# EAGLE design LoRa.v01h (EAGLE 7.7.0)
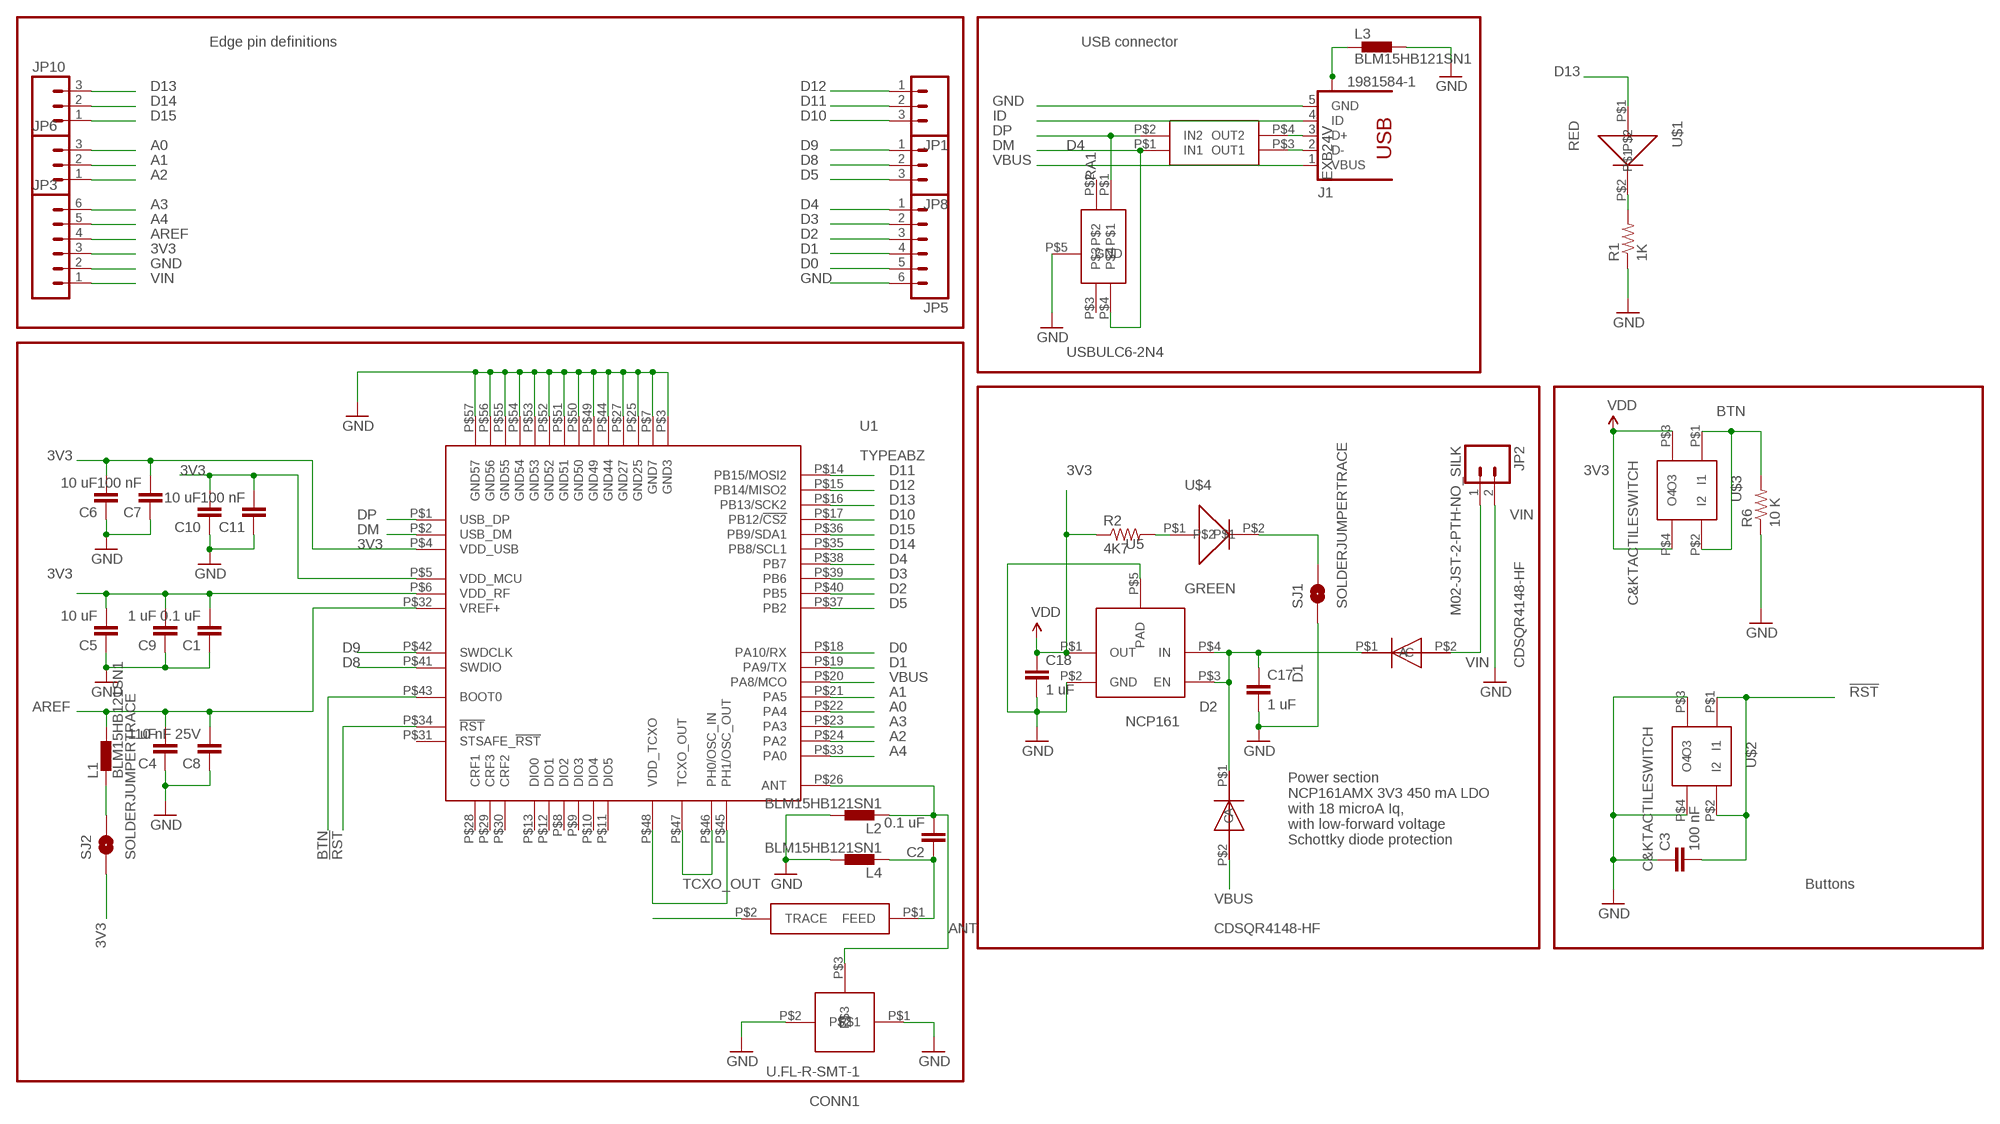
[diagram p0: schematic, sheet 1]

## Parts
C1  0.1 uF  0402CAP.KW  [0402-CAP]
C2  0.1 uF  0402CAP.KW  [0402-CAP]
C3  100 nF  0402CAP.KW  [0402-CAP]
C4  1 uF  0402CAP.KW  [0402-CAP]
C5  10 uF  0402CAP.KW  [0402-CAP]
C6  10 uF  0402CAP.KW  [0402-CAP]
C7  100 nF  0402CAP.KW  [0402-CAP]
C8  10 nF 25V  0402CAP.KW  [0402-CAP]
C9  1 uF  0402CAP.KW  [0402-CAP]
C10  10 uF  0402CAP.KW  [0402-CAP]
C11  100 nF  0402CAP.KW  [0402-CAP]
C17  1 uF  0402CAP.KW  [0402-CAP]
C18  1 uF  0402CAP.KW  [0402-CAP]
CONN1  U.FL-R-SMT-1  [U.FL-R-SMT-1]
D1  CDSQR4148-HF  [CDSQR4148-HF]
D2  CDSQR4148-HF  [CDSQR4148-HF]
D4  USBULC6-2N4  [USBULC6-2N4]
J1  1981584-1  [1981584-1]
JP1  M031X03_NO_SILK  [1X03_NO_SILK]
JP2  M02-JST-2-PTH-NO_SILK  [JST-2-PTH-NS]
JP3  M06NO_SILK  [1X06_NO_SILK]
JP5  M06NO_SILK  [1X06_NO_SILK]
JP6  M031X03_NO_SILK  [1X03_NO_SILK]
JP8  M031X03_NO_SILK  [1X03_NO_SILK]
JP10  M031X03_NO_SILK  [1X03_NO_SILK]
L1  BLM15HB121SN1  [0402]
L2  BLM15HB121SN1  [0402]
L3  BLM15HB121SN1  [0402]
L4  BLM15HB121SN1  [0402]
R1  1K  0402RES.KW  [0402-RES]
R2  4K7  0402RES.KW  [0402-RES]
R6  10 K  0402RES.KW  [0402-RES]
RA1  EXB24V  [EXB24V]
SJ1  SOLDERJUMPERTRACE  [SJ_2S-TRACE]
SJ2  SOLDERJUMPERTRACE  [SJ_2S-TRACE]
U1  TYPEABZ  [TYPEABZ]
U5  NCP161  [NCP161]
U$1  RED  0402LED  [0402LED]
U$2  C&KTACTILESWITCH  [C&KTACTILESWITCH]
U$3  C&KTACTILESWITCH  [C&KTACTILESWITCH]
U$4  GREEN  0402LED  [0402LED]
U$5  JOHANSON0900AT43A0070  [JOHANSON0900AT43A0070]

## Nets
3V3: C1.2 C5.2 C6.2 C7.2 C9.2 C10.2 C11.2 C18.1 JP3.3 R2.1 SJ2.1 U1.P$4(VDD_USB) U1.P$5(VDD_MCU) U1.P$6(VDD_RF) U5.P$1(OUT) U$3.P$3(O3) U$3.P$4(O4) ; supply symbol labelled VDD
!RST: C3.2 U1.P$34(!RST) U$2.P$1(I1) U$2.P$2(I2)
A0: JP6.3 U1.P$22(PA4)
A1: JP6.2 U1.P$21(PA5)
A2: JP6.1 U1.P$24(PA2)
A3: JP3.6 U1.P$23(PA3)
A4: JP3.5 U1.P$33(PA0)
ANT: C2.1 L4.1 U$5.P$1(FEED)
AREF: C4.2 C8.2 JP3.4 L1.2 U1.P$32(VREF+)
BTN: R6.2 U1.P$43(BOOT0) U$3.P$1(I1) U$3.P$2(I2)
D0: JP5.5 U1.P$18(PA10/RX)
D1: JP5.4 U1.P$19(PA9/TX)
D2: JP5.3 U1.P$40(PB5)
D3: JP5.2 U1.P$39(PB6)
D4: JP5.1 U1.P$38(PB7)
D5: JP8.3 U1.P$37(PB2)
D8: JP8.2 U1.P$41(SWDIO)
D9: JP8.1 U1.P$42(SWDCLK)
D10: JP1.3 U1.P$17(PB12/!CS2)
D11: JP1.2 U1.P$14(PB15/MOSI2)
D12: JP1.1 U1.P$15(PB14/MISO2)
D13: JP10.3 U1.P$16(PB13/SCK2) U$1.P$1
D14: JP10.2 U1.P$35(PB8/SCL1)
D15: JP10.1 U1.P$36(PB9/SDA1)
DM: D4.P$4 RA1.P$1(IN1) U1.P$2(USB_DM)
DP: D4.P$1 RA1.P$2(IN2) U1.P$1(USB_DP)
GND: C1.1 C3.1 C4.1 C5.1 C6.1 C7.1 C8.1 C9.1 C10.1 C11.1 C17.2 C18.2 CONN1.P$1 CONN1.P$2 D4.P$5(GND) J1.5(GND) JP2.2 JP3.2 JP5.6 L2.2 L3.2 L4.2 R1.1 R6.1 SJ1.1 U1.P$3(GND3) U1.P$7(GND7) U1.P$25(GND25) U1.P$27(GND27) U1.P$44(GND44) U1.P$49(GND49) U1.P$50(GND50) U1.P$51(GND51) U1.P$52(GND52) U1.P$53(GND53) U1.P$54(GND54) U1.P$55(GND55) U1.P$56(GND56) U1.P$57(GND57) U5.P$2(GND) U5.P$5(PAD) U$2.P$3(O3) U$2.P$4(O4)
ID: J1.4(ID)
N$1: R1.2 U$1.P$2
N$2: U$5.P$2(TRACE)
N$6: L1.1 SJ2.2
N$9: U1.P$45(PH1/OSC_OUT) U1.P$48(VDD_TCXO)
N$13: SJ1.2 U$4.P$2
N$31: J1.3(D+) RA1.P$4(OUT2)
N$32: C2.2 CONN1.P$3 L2.1 U1.P$26(ANT)
N$33: J1.2(D-) RA1.P$3(OUT1)
N$42: R2.2 U$4.P$1
N$60: C17.1 D1.P$1(C) D2.P$1(C) U5.P$3(EN) U5.P$4(IN)
TCXO_OUT: U1.P$46(PH0/OSC_IN) U1.P$47(TCXO_OUT)
USB_SHIELD: J1.S1 J1.S2 J1.S3 J1.S4 L3.1
VBUS: D2.P$2(A) J1.1(VBUS) U1.P$20(PA8/MCO)
VIN: D1.P$2(A) JP2.1 JP3.1
Unconnected: D4.P$2 D4.P$3 U1.P$8(DIO2) U1.P$9(DIO3) U1.P$10(DIO4) U1.P$11(DIO5) U1.P$12(DIO1) U1.P$13(DIO0) U1.P$28(CRF1) U1.P$29(CRF3) U1.P$30(CRF2) U1.P$31(STSAFE_!RST)

## Notes on the sheet
- Edge pin definitions | USB connector
- Power section
  NCP161AMX 3V3 450 mA LDO
  with 18 microA Iq, 
  with low-forward voltage 
  Schottky diode protection
- Buttons

## Library data of the parts
C1-C11 C17 C18 = SparkFun-Capacitors:0402CAP.KW
CONN1 = Kris:U.FL-R-SMT-1: U.FL-R-SMT-1
D1 D2 = Kris:CDSQR4148-HF: ComChip's CDSQR4148-HF high speed 150 mA Io diode
D4 = Kris:USBULC6-2N4: ST TVS diode ESD Protection USBULC6-2N4
J1 = con-usb:1981584-1: Receptacle, micro-USB, type A/B Tyco Electronics; MF: Hirose; MPN: ZX62-AB-5PA(11)
JP1 JP6 JP8 JP10 = SparkFun-Connectors:M03: Header 3 Standard 3-pin 0.1" header. Use with straight break away headers (SKU : PRT-00116), right angle break away headers (PRT-00553), swiss pins (PRT-00743), machine pins (PRT-00117), and female headers (PRT-00115). Molex polarized connector foot print use with SKU : PRT-08232 with associated crimp pins and housings.
JP2 = SparkFun-Connectors:M02: Standard 2-pin 0.1" header. Use with - straight break away headers ( PRT-00116) - right angle break away headers (PRT-00553) - swiss pins (PRT-00743) - machine pins (PRT-00117) - female headers (PRT-00115) Molex polarized connector foot print use with: PRT-08233 with associated crimp pins and housings. 2.54_SCREWTERM for use with PRT-10571. 3.5mm Screw Terminal footprints for PRT-08084 5mm Screw Terminal footprints for use with PRT-08433
JP3 JP5 = SparkFun-Connectors:M06: Header 6 Standard 6-pin 0.1" header. Use with straight break away headers (SKU : PRT-00116), right angle break away headers (PRT-00553), swiss pins (PRT-00743), machine pins (PRT-00117), and female headers (PRT-00115). Molex polarized connector foot print use with SKU : PRT-08094 with associated crimp pins and housings. NOTES ON THE VARIANTS LOCK and LOCK_LONGPADS... This footprint was designed to help hold the alignment of a through-hole component (i.e. 6-pin header) while soldering it into place. You may notice that each hole has been shifted either up or down by 0.005 of an inch from it's more standard position (which is a perfectly straight line). This slight alteration caused the pins (the squares in the middle) to touch the edges of the holes. Because they are alternating, it causes a "brace" to hold the component in place. 0.005 has proven to be the perfect amount of "off-center" position when using our standard breakaway headers. Although looks a little odd when you look at the bare footprint, once you have a header in there, the alteration is very hard to notice. Also,if you push a header all the way into place, it is covered up entirely on the bottom side. This idea of altering the position of holes to aid alignment will be further integrated into the Sparkfun Library for other footprints. It can help hold any component with 3 or more connection pins.
L1-L4 = inductors:BLM15H: EMIFIL (R) Chip Ferrite Bead for GHz Noise Source: http://www.murata.com/ Ferrite Bead BLM15H.pdf
R1 R2 R6 = SparkFun-Resistors:0402RES.KW
RA1 = Kris:EXB24V: Panasonic EXB24 22 Ohm series resistor pair
SJ1 SJ2 = SparkFun-Passives:SOLDERJUMPER: Solder Jumper Standard SMD solder jumper. Used to automate production. Two varients : Normally Open and Normally Closed are the same, but have different paste layers. NC will have a large amount of paste and should jumper during reflow.
U1 = Kris:TYPEABZ: CMWX1ZZABZ-078
U5 = Kris:NCP161: NCP161 3V3 LDO voltage regulator
U$1 U$4 = Kris:0402LED: 0402led
U$2 U$3 = Kris:C&KTACTILESWITCH: C&K Tactile Switch 611-PTS810SJS250SMTR
U$5 = Kris:JOHANSON0900AT43A0070: Johanson dual wide band antenna http://www.mouser.com/new/Johanson/johanson-0900at43a0070/

## Board
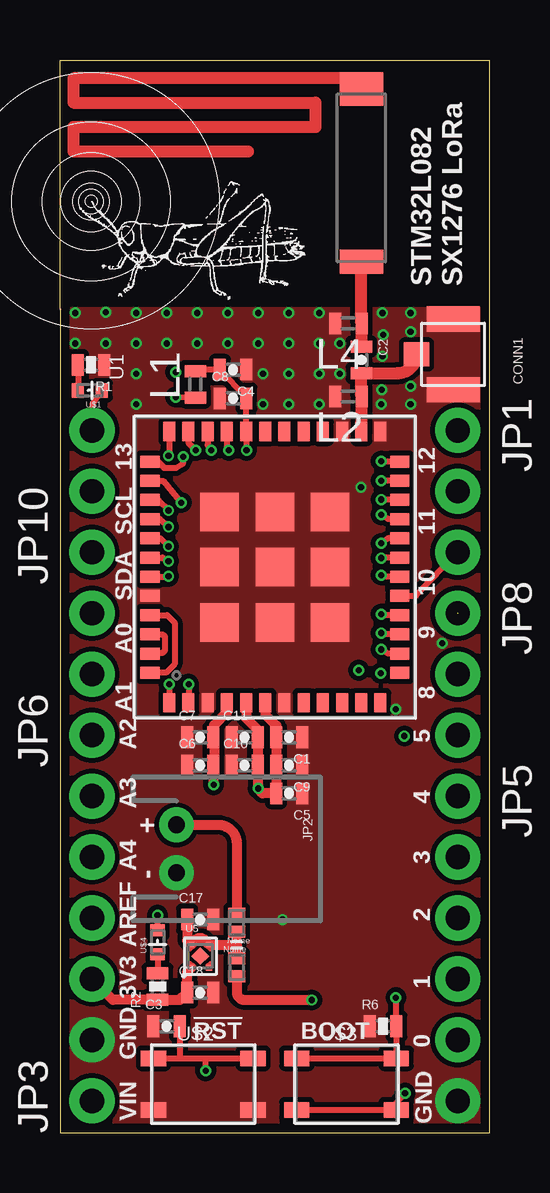
[diagram p1: board, top side]
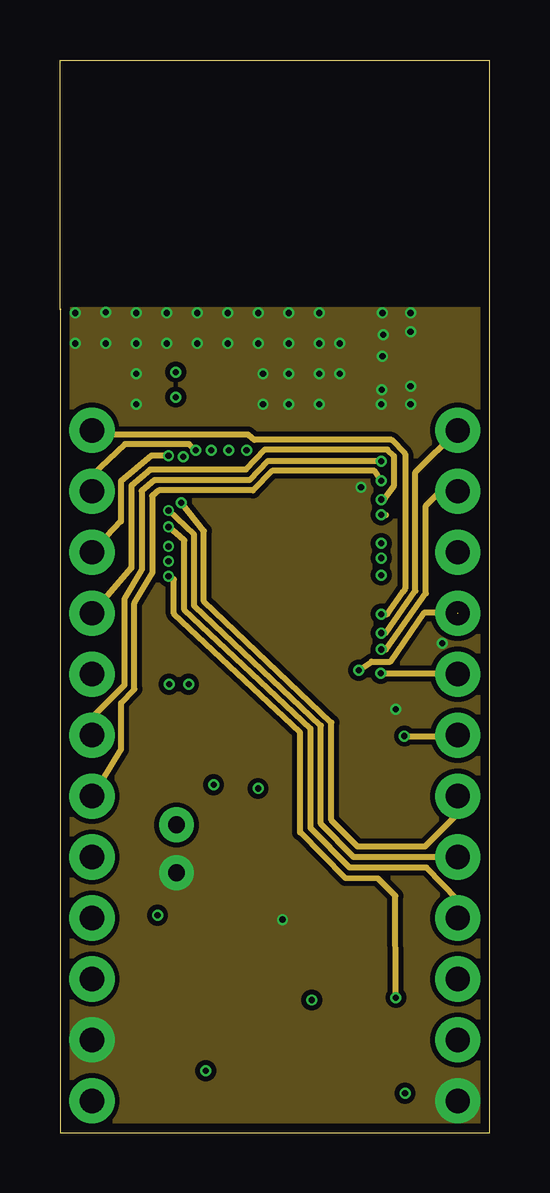
[diagram p2: board, inner layer Route2]
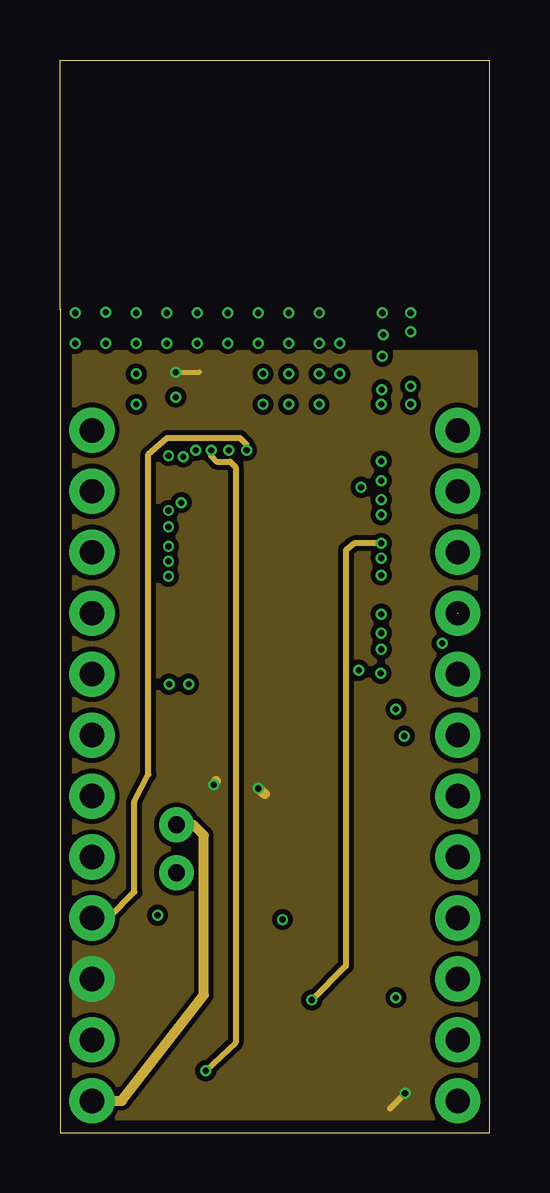
[diagram p3: board, inner layer Route15]
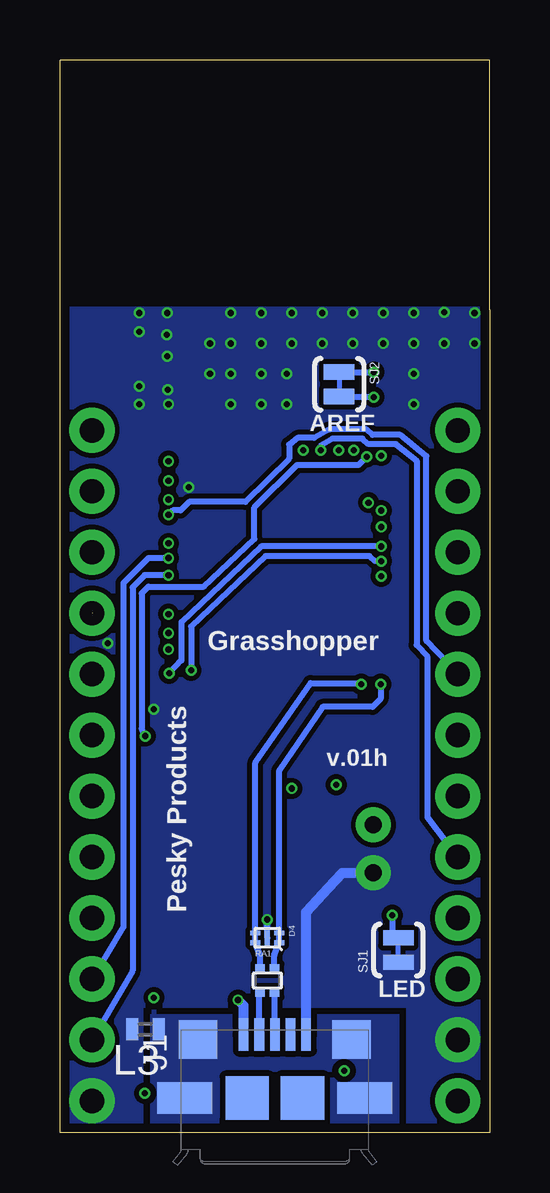
[diagram p4: board, bottom side, seen from below]

Size 17.91 x 44.7 mm. Coordinates in mm from the lower left corner, seen from the top.
Outline: 0,34.29 0,0 17.91,0 17.91,44.7 0,44.7 0,34.29
Outline: 0.03,34.31 0,34.29
Copper layers (1*2*15*16): Top 0.035559375mm / dielectric 0.17018125mm / Route2 0.01778125mm / dielectric 47mil / Route15 0.01778125mm / dielectric 0.17018125mm / Bottom 0.035559375mm
Design rules "OSHPark-4layer *": minimum track width 5mil, minimum drill 10mil, track to track 5mil, track to pad 5mil, pad to pad 5mil, via to via 5mil, smd to smd 5mil, copper to edge 15mil, drill to drill 6mil, minimum pad ring 4mil, minimum via ring 4mil, stop-mask expansion 4mil, vias tented up to drill 20mil, thermal gap 10mil

### Footprints (pad centres in the part's own frame; a part is rotated, then mirrored left to right if it is on the bottom)
0402-CAP = smd 0.5 x 0.9: 1 -0.55,0; 2 0.55,0
U.FL-R-SMT-1 = smd 1.05 x 2.2: P$1 -1.475,0; P$2 1.475,0 | smd 1 x 1.05: P$3 0,-1.525
CDSQR4148-HF = smd 0.7 x 0.5: P$1 0,0.375; P$2 0,-0.375
USBULC6-2N4 = smd 0.2 x 0.4: P$1 0.2,0.5; P$2 -0.2,0.5; P$3 -0.2,-0.5; P$4 0.2,-0.5 | smd 0.6 x 0.2: P$5 0,0
1981584-1 = smd 0.4 x 1.35: 1 -1.3,4.1; 2 -0.65,4.1; 3 0,4.1; 4 0.65,4.1; 5 1.3,4.1 | smd 1.8 x 1.8: M1 -1.15,1.45; M2 1.15,1.45 | smd 2.3 x 1.3: S1 -3.75,1.45; S2 3.75,1.45 | smd 1.6 x 1.6: S3 -3.2,3.885; S4 3.2,3.885
1X03_NO_SILK = drill 1.016 pad 1.88: 1 0,0; 2 2.54,0; 3 5.08,0
JST-2-PTH-NS = drill 0.7 pad 1.448: 1 -1,0; 2 1,0
1X06_NO_SILK = drill 1.016 pad 1.88: 1 0,0; 2 2.54,0; 3 5.08,0; 4 7.62,0; 5 10.16,0; 6 12.7,0
0402 = smd 0.5 x 0.9: 1 -0.55,0; 2 0.55,0
0402-RES = smd 0.5 x 0.9: 1 -0.55,0; 2 0.55,0
EXB24V = smd 0.4 x 0.36: P$1 -0.3,0.5; P$2 0.3,0.5; P$3 -0.3,-0.5; P$4 0.3,-0.5
SJ_2S-TRACE = smd 0.635 x 1.27: 1 -0.508,0; 2 0.508,0
TYPEABZ = smd 0.8 x 0.5: P$1 -5.65,4.4; P$2 -5.65,3.6; P$3 -5.65,2.8; P$4 -5.65,2; P$5 -5.65,1.2; P$6 -5.65,0.4; P$7 -5.65,-0.4; P$8 -5.65,-1.2; P$9 -5.65,-2; P$10 -5.65,-2.8; P$11 -5.65,-3.6; P$12 -5.65,-4.4; P$25 5.65,-4.4; P$26 5.65,-3.6; P$27 5.65,-2.8; P$28 5.65,-2; P$29 5.65,-1.2; P$30 5.65,-0.4; P$31 5.65,0.4; P$32 5.65,1.2; P$33 5.65,2; P$34 5.65,2.8; P$35 5.65,3.6; P$36 5.65,4.4 | smd 0.5 x 0.8: P$13 -4.4,-5.2; P$14 -3.6,-5.2; P$15 -2.8,-5.2; P$16 -2,-5.2; P$17 -1.2,-5.2; P$18 -0.4,-5.2; P$19 0.4,-5.2; P$20 1.2,-5.2; P$21 2,-5.2; P$22 2.8,-5.2; P$23 3.6,-5.2; P$24 4.4,-5.2; P$37 4.4,5.2; P$38 3.6,5.2; P$39 2.8,5.2; P$40 2,5.2; P$41 1.2,5.2; P$42 0.4,5.2; P$43 -0.4,5.2; P$44 -1.2,5.2; P$45 -2,5.2; P$46 -2.8,5.2; P$47 -3.6,5.2; P$48 -4.4,5.2 | smd 1.6 x 1.6: P$49 -2.3,2.3; P$50 0,2.3; P$51 2.3,2.3; P$52 -2.3,0; P$53 0,0; P$54 2.3,0; P$55 -2.3,-2.3; P$56 0,-2.3; P$57 2.3,-2.3
NCP161 = smd 0.24 x 0.24: P$1 -0.37,-0.48; P$2 0.37,-0.48; P$3 0.37,0.48; P$4 -0.37,0.48 | smd 0.52 x 0.52 rotated 45: P$5 0,0
0402LED = smd 0.5 x 0.6: P$1 -0.5,0; P$2 0.5,0
C&KTACTILESWITCH = smd 1.05 x 0.65: P$1 -2.075,1.073; P$2 2.075,1.075; P$3 -2.075,-1.075; P$4 2.075,-1.075
JOHANSON0900AT43A0070 = smd 1 x 1.8: P$1 -3.5,0 | smd 1.4 x 1.8: P$2 3.7,0

### Placement (x,y rotation side)
C1  9.55,16.48 180 top
C2  12.56,32.21 270 top
C3  4.45,4.45 0 top
C4  7.21,31.8 180 top
C5  9.55,14.15 180 top
C6  5.84,15.32 0 top
C7  5.84,16.48 0 top
C8  7.21,30.61 0 top
C9  9.55,15.32 180 top
C10  7.7,15.32 0 top
C11  7.7,16.48 0 top
C17  5.84,8.89 0 top
C18  5.84,5.84 0 top
CONN1  16.38,32.44 270 top
D1  7.37,8.76 180 top
D2  7.37,6.91 0 top
D4  9.27,8.13 270 bottom
J1  8.95,0 0 bottom
JP1  16.57,29.27 270 top
JP2  4.85,11.84 270 top
JP3  1.33,1.33 90 top
JP5  16.57,14.03 270 top
JP6  1.33,16.57 90 top
JP8  16.57,21.65 270 top
JP10  1.33,24.19 90 top
L1  5.64,31.19 90 top
L2  12.01,30.68 180 top
L3  14.35,4.32 180 bottom
L4  12.01,33.73 180 top
R1  1.3,32 180 top
R2  4.06,6.1 90 top
R6  13.46,4.45 0 top
RA1  9.27,6.35 0 bottom
SJ1  3.81,7.62 90 bottom
SJ2  6.27,31.19 270 bottom
U1  8.95,23.57 90 top
U5  5.84,7.37 0 top
U$1  1.24,30.94 180 top
U$2  5.97,2.03 0 top
U$3  11.94,2.03 0 top
U$4  4.06,7.95 90 top
U$5  12.56,39.79 90 top
U$6  [GRASSHOPPER]  0.58,34.62 0 top

### Tracks (layer width: path | path; a pad name or v marks a point on that pad's centre or on a via)
3V3  (via drill 0.25)
  Top 0.254: v14.38,1.65 13.73,0.98 U$3.P$4 U$3.P$3
  Top 0.406: U5.P$1 5.29,6.71 C18.1 5,5.55 R2.1 2.2,5.55 JP3.3 | U1.P$5 7.75,17.28 8.25,16.79 C11.2 C10.2 8.25,14.49 v8.26,14.35 8.43,14.15 C5.2 C9.2 C1.2 9.02,16.5 9.02,16.97 8.55,17.43 U1.P$6 | 6.91,17.93 U1.P$4 6.95,17.52 6.43,16.99 6.43,16.52 | v6.4,14.5 6.39,14.75 C6.2 6.43,15.35 6.43,16.52 | 6.43,16.52 C7.2
  Route15 0.203: v4.83,31.7 5.82,31.7
  Route15 0.254: v14.38,1.65 13.74,1.02
  Route15 0.406: v8.26,14.35 8.53,14.12 | v6.4,14.5 6.5,14.66
  Bottom 0.254: SJ2.1 v4.83,31.7
  pour Route15 (isolate 0.203, no thermals): 0.64,32.51 17.27,32.51 17.27,0.64 0.64,0.64
!RST  (via drill 0.25)
  Top 0.254: U$2.P$1 5,3.1 | 5,3.1 6.07,3.1 | 6.07,3.1 8.17,3.1 U$2.P$2 | C3.2 5,3.11 5,3.1 | U1.P$34 6.15,28.67 v6.3,28.45 | v6.07,2.59 6.07,3.1
  Route15 0.254: v6.3,28.45 6.3,28.22 6.53,27.96 7.09,27.96 7.32,27.74 7.32,3.76 v6.07,2.59
A0  (via drill 0.25)
  Top 0.254: U1.P$22 13.56,26.37 v13.39,26.39
  Route2 0.254: v13.39,26.39 13.54,26.44 13.92,26.98 13.92,28.19 13.64,28.47 8.53,28.47 7.75,27.64 3.76,27.64 2.97,26.98 2.97,23.55 JP6.3
A1  (via drill 0.25)
  Top 0.254: U1.P$21 13.67,25.57 v13.39,25.76
  Route2 0.254: v13.39,25.76 13.59,25.76
  Bottom 0.254: JP6.2 1.33,19.14 2.64,20.5 2.64,28.19 3.73,29.08 4.88,29.08 5.13,29.31 6.68,29.31 7.32,28.96 8,28.96 8.36,28.68 8.36,28.09 10.19,26.29 12.52,26.29 12.88,25.93 13.21,25.93 v13.39,25.76
A2  (via drill 0.25)
  Top 0.254: U1.P$24 13.42,27.97 v13.39,27.99
  Route2 0.254: v13.39,27.99 8.66,27.99 7.9,27.2 3.94,27.2 3.4,26.75 3.4,23.44 2.69,22.25 2.69,18.67 1.33,17.31 JP6.1
A3  (via drill 0.25)
  Top 0.254: U1.P$23 13.73,27.18 v13.39,27.18
  Route2 0.254: v13.39,27.18 13.11,27.58 8.84,27.58 8.05,26.77 4.12,26.77 3.83,26.54 3.83,23.32 3.1,22.07 3.1,18.49 2.54,17.91 2.54,15.98 JP3.6
A4  (via drill 0.25)
  Top 0.254: U1.P$33 6.95,28.5 v7.04,28.45
  Bottom 0.254: v7.04,28.45 7.04,28.65 6.55,28.93 5.31,28.93 5.05,28.7 3.91,28.7 3.05,28.02 3.05,20.32 2.59,19.84 2.59,13.13 JP3.5
ANT
  Top 0.305: C2.1 | L4.1
  Top 0.508: C2.1 L4.1 | L4.1 U$5.P$1
AREF  (via drill 0.25)
  Top 0.254: L1.2 5.68,31.8 C4.2 7.76,30.62 C8.2 7.76,29.22 U1.P$32 7.77,29.02 v7.77,28.45
  Route15 0.254: JP3.4 2.02,8.95 3.1,10.05 3.1,13.82 3.68,14.94 3.68,28.27 4.47,28.96 7.49,28.96 7.77,28.68 v7.77,28.45
BTN  (via drill 0.25)
  Top 0.254: U$3.P$1 13.76,3.1 U$3.P$2 14.01,3.36 R6.2 13.99,4.46 v13.99,5.64 | U1.P$43 4.5,23.17 v4.52,23.19
  Route2 0.254: v13.99,5.64 13.97,9.88 13.26,10.59 11.89,10.62 10.01,12.52 10.01,16.69 4.75,21.64 4.75,23.06 v4.52,23.19
D0  (via drill 0.25)
  Top 0.254: U1.P$18 13.46,23.17 v13.39,23.24
  Bottom 0.254: v13.39,23.24 14.38,23.24 14.88,22.73 14.88,6.76 JP5.5
D1  (via drill 0.25)
  Top 0.254: U1.P$19 13.46,23.97 v13.39,23.95
  Bottom 0.254: v13.39,23.95 14.22,23.95 15.27,22.91 15.27,8.59 JP5.4
D2  (via drill 0.25)
  Top 0.254: U1.P$40 4.17,25.58 v4.52,25.25
  Route2 0.254: v4.52,25.25 5.18,24.69 5.18,21.79 10.44,16.84 10.44,12.7 12.06,11.05 15.27,11.05 16.57,9.69 JP5.3
D3  (via drill 0.25)
  Top 0.254: U1.P$39 3.79,26.34 4.12,26.34 v4.52,25.93
  Route2 0.254: JP5.2 12.23,11.49 10.87,12.88 10.87,16.97 5.59,21.97 5.59,24.94 v4.52,25.93
D4  (via drill 0.25)
  Top 0.254: 3.79,27.2 U1.P$38 4.3,27.17 v5.05,26.26
  Route2 0.254: v5.05,26.26 5.99,25.07 5.99,22.15 11.3,17.09 11.3,13.03 12.39,11.94 15.21,11.94 16.57,13.3 JP5.1
D5  (via drill 0.25)
  Top 0.254: U1.P$37 4.08,27.97 4.34,27.71 4.83,27.71 5.13,27.89 v5.13,28.17
  Route2 0.254: v14.35,16.54 16.54,16.54 JP8.3
  Bottom 0.254: v14.35,16.54 14.5,16.84 14.5,22.48 14.22,22.76 11.91,22.76 9.8,24.74 9.8,26.06 8.03,27.84 5.46,27.84 v5.13,28.17
D8  (via drill 0.25)
  Top 0.254: U1.P$41 4.18,24.77 v4.52,24.43
  Route2 0.254: v13.36,19.15 16.54,19.15 JP8.2
  Bottom 0.254: v4.52,24.43 9.53,24.43 12.85,21.29 12.85,19.68 v13.36,19.15
D9  (via drill 0.25)  (1 unrouted)
  Top 0.254: U1.P$42 4.27,23.97 v4.52,23.82
  Route2 0.254: v12.45,19.28 12.98,19.63 13.77,19.63 15.16,21.67 16.56,21.67
  Bottom 0.254: v4.52,23.82 4.78,23.82 5,24.03 9.35,24.03 12.45,21.11 v12.45,19.28
D10
  Top 0.254: U1.P$17 14.83,22.37 JP1.3
D11  (via drill 0.25)
  Top 0.254: U1.P$14 13.66,19.97 v13.39,20.14
  Route2 0.254: v13.39,20.14 13.59,20.14 15.24,22.48 15.24,26.14 15.84,26.73 JP1.2
D12  (via drill 0.25)
  Top 0.254: U1.P$15 13.44,20.77 v13.39,20.83
  Route2 0.254: v13.39,20.83 13.56,20.83 14.81,22.58 14.81,27.53 JP1.1
D13  (via drill 0.25)
  Top 0.254: U$1.P$1 1.35,30.38 1.35,29.29 JP10.3 | U1.P$16 13.48,21.57 v13.39,21.61
  Route2 0.254: JP10.3 1.51,29.1 7.84,29.1 8.1,28.88 13.82,28.88 14.38,28.3 14.38,22.68 14.28,22.53 13.64,21.61 v13.39,21.61
D14  (via drill 0.25)
  Top 0.254: U1.P$35 5.35,28.76 v5.66,28.45
  Route2 0.254: v5.66,28.45 5.38,28.7 2.72,28.7 1.33,27.39 JP10.2
D15  (via drill 0.25)
  Top 0.254: U1.P$36 4.55,28.25 v4.52,28.22
  Route2 0.254: v4.52,28.22 3.81,28.22 2.54,27.15 2.54,25.48 1.29,24.18 1.32,24.21 JP10.1
DM  (via drill 0.25)
  Top 0.254: v5.36,18.69 5.36,18.16 U1.P$2
  Bottom 0.254: RA1.P$1 9.57,7.4 D4.P$4 9.77,15.43 7.47,18.75 5.44,18.75 v5.36,18.69
DP  (via drill 0.25)
  Top 0.254: v4.55,18.69 U1.P$1
  Bottom 0.254: RA1.P$2 8.97,7.4 D4.P$1 8.77,15.11 6.97,17.75 4.88,17.75 4.55,18.09 v4.55,18.69
GND  (via drill 0.25)
  Bottom 0.254: D4.P$5 v9.27,8.89
  Bottom 0.406: J1.5 7.65,9.21 6.73,10.21 6.16,10.84 JP2.2
  other vias: 12.54,26.9 13.39,30.35 11.66,32.89 11.66,31.62 10.79,31.62 1.91,34.19 3.17,34.16 4.45,34.16 5.71,34.16 13.44,34.16 10.79,34.16 9.53,34.16 8.26,34.16 14.61,34.16 0.64,34.16 10.79,30.35 13.44,32.36 13.41,30.96 10.79,32.89 6.99,34.16 14.61,33.38 14.61,31.11 14.61,30.35 0.64,32.89 1.91,32.89 3.17,32.89 4.45,32.89 5.71,32.89 6.99,32.89 8.26,32.89 9.53,32.89 9.53,31.62 8.46,31.62 8.46,30.35 9.53,30.35 3.17,31.62 3.17,30.35 14,17.65 13.46,33.25 15.93,20.4
  pour Top (isolate 0.203, no thermals): 0,34.29 17.91,34.29 17.91,0 0,0
  pour Route2 (isolate 0.203, no thermals): 0,34.29 17.91,34.29 17.91,0 0,0
  pour Bottom (isolate 0.203, no thermals): 3.37,0 0,0 0,34.29 17.91,34.29 17.91,0 14.54,0 14.54,5.33 3.37,5.33
N$1
  Top 0.254: R1.2 0.75,31.22 U$1.P$2
N$4
  Top 0.508: 11.71,43.94 0.56,43.94 0.56,42.93
N$5
  Top 0.508: 0.56,42.93 10.64,42.93 10.64,41.91 0.56,41.91 0.56,40.89 7.82,40.89
N$6  (via drill 0.25)
  Top 0.254: L1.1 5.55,30.64 v4.83,30.66
  Bottom 0.203: 5.82,30.66 SJ2.2
  Bottom 0.254: v4.83,30.66 5.82,30.66
N$9
  Top 0.254: U1.P$45 4.46,21.57 4.78,21.26 4.78,19.53 4.42,19.18 U1.P$48
N$13  (via drill 0.25)
  Top 0.254: U$4.P$2 v4.06,9.07
  Bottom 0.254: v4.06,9.07 4.06,8.38 SJ1.2
N$31
  Bottom 0.254: J1.3 8.95,5.83 RA1.P$4
N$32
  Top 0.254: U1.P$26
  Top 0.305: U1.P$26 12.56,29.22 | L2.1
  Top 0.508: 12.56,29.22 L2.1 | L2.1 C2.2 14.05,31.66 arc90 CONN1.P$3
N$33
  Bottom 0.254: J1.2 9.6,5.82 RA1.P$3
N$42
  Top 0.254: U$4.P$1 R2.2
N$60
  Top 0.406: D2.P$1 7.37,7.8 | 7.37,7.8 D1.P$1 | 7.37,7.8 7.32,7.85 U5.P$3 5.94,8.1 5.73,8.1 U5.P$4 5.29,8.03 C17.1
TCXO_OUT
  Top 0.254: U1.P$46 4.27,20.77 4.37,20.68 4.37,20.09 4.27,19.99 3.77,19.99 U1.P$47
USB_SHIELD
  pour Bottom (isolate 0.254, rank 3, no thermals): 3.87,0 3.87,5.21 14.03,5.21 14.03,0
VBUS  (via drill 0.25)
  Top 0.254: U1.P$20 13.67,24.77 v13.39,24.56
  Top 0.406: v10.49,5.54 7.7,5.54 arc-90 7.37,5.87 D2.P$2
  Route15 0.254: 10.46,5.56 v10.49,5.54 11.91,6.96 11.91,24.28 12.27,24.56 v13.39,24.56
  Bottom 0.406: J1.1 10.25,5.3 v10.49,5.54
VIN
  Top 0.406: JP2.1 6.59,12.84 arc-90 7.37,12.06 D1.P$2
  Route15 0.406: JP3.1 2.58,1.33 5.99,5.74 5.99,12.39 5.55,12.84 JP2.1

### Text on the board
tPlace: STM32L082 / SX1276 LoRa | 13 | 12 | SCL | 11 | SDA | 10 | 9 | A0 | A1 | 8 | A2 | 5 | A3 | 4 | + | A4 | - | 3 | 2 | AREF | 3V3 | 1 | !RST | BOOT | 0 | GND | VIN | GND
bPlace: AREF | Grasshopper | Pesky Products | v.01h | LED